# Altium schematic sheet Rail.SchDoc
size A
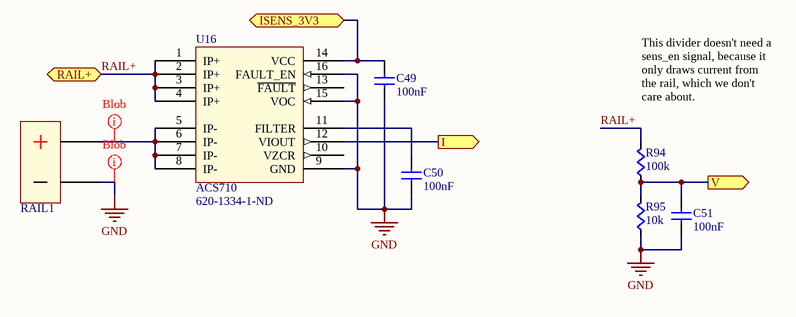
[diagram p0: Rail.SchDoc]

## Parts
C49  value 100nF  [CAPC0603]  (hidden comment: Cap)
C50  value 100nF  [CAPC0603]  (hidden comment: Cap)
C51  value 100nF  [CAPC0603]  (hidden comment: Cap)
R94  value 100k  [RES0603]  (hidden comment: Res)
R95  value 10k  [RES0603]  (hidden comment: Res)
RAIL1  BATWIRE  [BATWIRE12]  (value not drawn)
U16  ACS710  Supplier Part Number 1: 620-1334-1-ND  [ACS710]

## Ports
I (out), ISENS_3V3, RAIL+ (bidir), V (out)

## Nets
GND: C49.2(B) C50.2(B) C51.2(B) R95.2(B) RAIL1.- U16.9(GND) U16.15(VOC) U16.16(FAULT_EN)
I: U16.12(VIOUT) ; port I
ISENS_3V3: C49.1(A) U16.14(VCC) ; port ISENS_3V3
RAIL+: R94.1(A) U16.1(IP+) U16.2(IP+) U16.3(IP+) U16.4(IP+) ; port RAIL+
V: C51.1(A) R94.2(B) R95.1(A) ; port V
NetC50_1: C50.1(A) U16.11(FILTER)
NetRAIL1_+: RAIL1.+ U16.5(IP-) U16.6(IP-) U16.7(IP-) U16.8(IP-)

Not connected (* = marked no-connect by the designer): U16 10(VZCR) 13(~{FAULT})

## Layout directives
net class Blob: GND, NetRAIL1_+

## Notes on the sheet
- (near R94) This divider doesn't need a sens_en signal, because it only draws current from the rail, which we don't care about.

## Library data of the parts
RAIL1 = BATWIRE: Two large gauge leads soldered directly to the board.
U16 = ACS710: Current Sensor with Integrated Overcurrent Detection; Supplier 1: Digi-Key
C49-C51 = Cap: Supplier 1: Digi-Key; Supplier Part Number 1: 1276-1000-1-ND
R94 R95 = Res: Supplier 1: Digi-Key
  R94: Supplier Part Number 1: RR08P100KDCT-ND
  R95: Supplier Part Number 1: RR08P10.0KDCT-ND